# EAGLE schematic schematic (EAGLE 9.6.2)
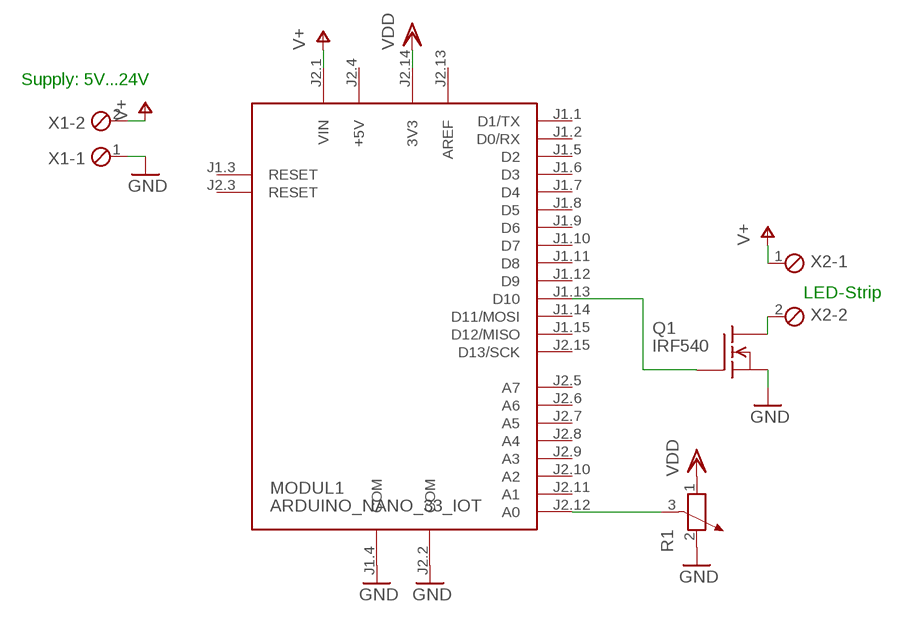
[diagram p0: schematic, sheet 1]

## Parts
MODUL1  ARDUINO_NANO_33_IOT  [ARDUINO_NANO2]
Q1  IRF540  [TO220]
R1  POTENTIOMETER_PT-10  [PT-10]
X1  MPT2  [2POL254]
X2  MPT2  [2POL254]

## Nets
GND: MODUL1.J1.4(COM) MODUL1.J2.2(COM) Q1.3(S) R1.2 X1.1
N$1: MODUL1.J2.12(A0) R1.3
N$2: MODUL1.J1.13(D10) Q1.1(G)
N$3: Q1.2(D) X2.2
V+: MODUL1.J2.1(VIN) X1.2 X2.1
VDD: MODUL1.J2.14(3V3) R1.1
Unconnected: MODUL1.J1.1(D1/TX) MODUL1.J1.2(D0/RX) MODUL1.J1.3(RESET) MODUL1.J1.5(D2) MODUL1.J1.6(D3) MODUL1.J1.7(D4) MODUL1.J1.8(D5) MODUL1.J1.9(D6) MODUL1.J1.10(D7) MODUL1.J1.11(D8) MODUL1.J1.12(D9) MODUL1.J1.14(D11/MOSI) MODUL1.J1.15(D12/MISO) MODUL1.J2.3(RESET) MODUL1.J2.5(A7) MODUL1.J2.6(A6) MODUL1.J2.7(A5) MODUL1.J2.8(A4) MODUL1.J2.9(A3) MODUL1.J2.10(A2) MODUL1.J2.11(A1) MODUL1.J2.15(D13/SCK)

## Notes on the sheet
- Supply: 5V...24V
- LED-Strip

## Power pins joined to a net without a drawn wire
+5V: MODUL1.J2.4(+5V)
AREF: MODUL1.J2.13(AREF)

## Library data of the parts
MODUL1 = arduino:ARDUINO_NANO_33_IOT: Arduino Nano 33 IoT Auto generated by modulcreator.ulp \;; ANZAHL: 2; MODUL: TRUE; STECKX0: -76200; STECKX1: 76200; STECKY0: 177800; STECKY1: 177800
Q1 = transistor-fet:IRF540: N-Channel Enhancement MOSFET (HEXFET); 100V; 28A; 0,077Ohm
R1 = rcl:POTENTIOMETER_: Potentiometer; SPICEMODEL: POT; SPICEPREFIX: X
X1 X2 = con-phoenix-254:MPT2: PHOENIX CONNECTOR; OC_FARNELL: unknown; OC_NEWARK: unknown